# Altium schematic sheet Sheet2.SchDoc
size A; SheetNumber: 2; SheetTotal: 2
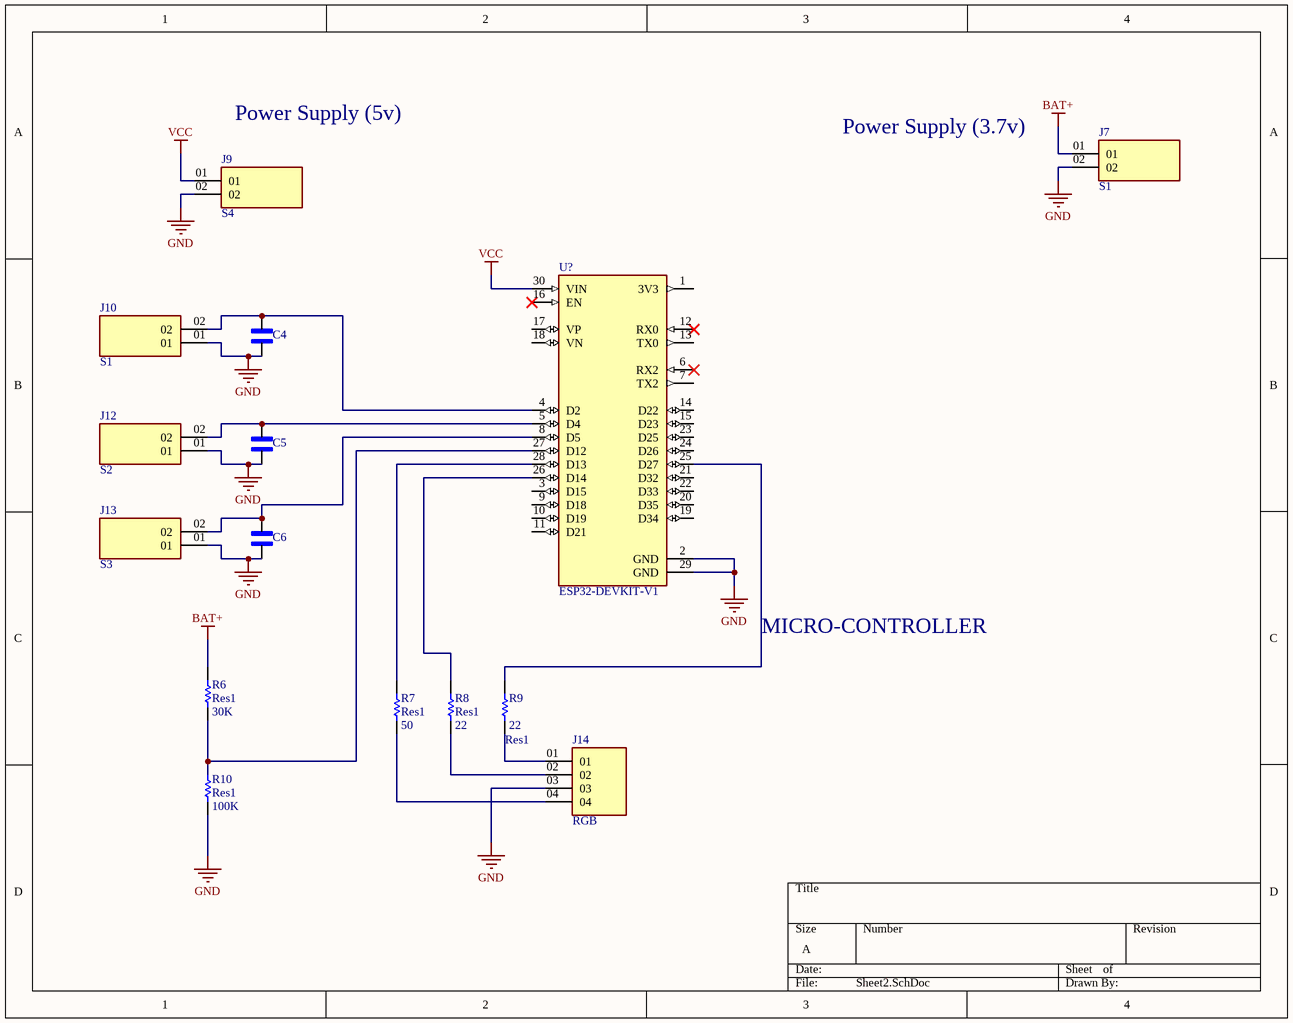
[diagram p0: Sheet2.SchDoc]

## Parts
C4  C315C470J1G5TA  [CAPRR254W54L381T254H466]  (value not drawn)
C5  C315C470J1G5TA  [CAPRR254W54L381T254H466]  (value not drawn)
C6  C315C470J1G5TA  [CAPRR254W54L381T254H466]  (value not drawn)
J7  S1  [SAMTEC_TSW-202-07-T-S]
J9  S4  [SAMTEC_TSW-202-07-T-S]
J10  S1  [SAMTEC_TSW-202-07-T-S]
J12  S2  [SAMTEC_TSW-202-07-T-S]
J13  S3  [SAMTEC_TSW-202-07-T-S]
J14  RGB  [SAMTEC_MTLW-104-X-X-S-X]
R6  Res1  value 30K  [AXIAL-0.3]
R7  Res1  value 50  [AXIAL-0.3]
R8  Res1  value 22  [AXIAL-0.3]
R9  Res1  value 22  [AXIAL-0.3]
R10  Res1  value 100K  [AXIAL-0.3]
U?  ESP32-DEVKIT-V1  [MODULE_ESP32_DEVKIT_V1]

## Nets
BAT+: J7.01 R6.1
GND: C4.1 C5.1 C6.1 J7.02 J9.02 J10.01 J12.01 J13.01 J14.03 R10.2 U?.2(GND) U?.29(GND)
VCC: J9.01 U?.30(VIN)
NetC4_2: C4.2 J10.02 U?.4(D2)
NetC5_2: C5.2 J12.02 U?.5(D4)
NetC6_2: C6.2 J13.02 U?.8(D5)
NetJ14_01: J14.01 R9.2
NetJ14_02: J14.02 R8.2
NetJ14_04: J14.04 R7.2
NetR6_2: R6.2 R10.1 U?.27(D12)
NetR7_1: R7.1 U?.28(D13)
NetR8_1: R8.1 U?.26(D14)
NetR9_1: R9.1 U?.25(D27)

Not connected (* = marked no-connect by the designer): U? 1(3V3) 3(D15) 6(RX2)* 7(TX2) 9(D18) 10(D19) 11(D21) 12(RX0)* 13(TX0) 14(D22) 15(D23) 16(EN)* 17(VP) 18(VN) 19(D34) 20(D35) 21(D32) 22(D33) 23(D25) 24(D26)

## Notes on the sheet
- Power Supply (5v)
- (near J7) Power Supply (3.7v)
- MICRO-CONTROLLER

## Library data of the parts
C4-C6 = C315C470J1G5TA: Capacitor: ceramic; MLCC, monolithic; 47pF; 100V; C0G; Â±5%; THT; MF: KEMET; SnapEDA_Link: https://www.snapeda.com/parts/C315C470J1G5TA/KEMET/view-part/?ref=snap; Package: Radial Kemet; Value: *; MP: C315C470J1G5TA; Check_prices: https://www.snapeda.com/parts/C315C470J1G5TA/KEMET/view-part/?ref=eda
J7 J9 J10 J12 J13 = TSW-202-07-T-S: Value: *; MP: TSW-202-07-T-S; Availability: Unavailable; Package: None; Price: None
J14 = MTLW-104-X-X-S-X: MF: {'manufacturer': u'Samtec Inc.'}; Package: None; Price: None; Value: *; MP: MTLW-104-X-X-S-X; Availability: Unavailable
R6-R10 = Res1: Resistor; Published: 8-Jun-2000; LatestRevisionDate: 17-Jul-2002; LatestRevisionNote: Re-released for DXP Platform.; PackageReference: AXIAL-0.3; Publisher: Altium Limited; PackageDescription: Axial Device, Thru-Hole; 2 Leads; 0.3 in Pin Spacing
U? = ESP32-DEVKIT-V1: Dual core, Wi-Fi: 2.4 GHz up to 150 Mbits/s,BLE (Bluetooth Low Energy) and legacy Bluetooth, 32 bits, Up to 240 MHz; MF: Do it; Price: None; Availability: Not in stock; Package: None; MP: ESP32-DEVKIT-V1; Value: *; SnapEDA_Link: https://www.snapeda.com/parts/ESP32-DEVKIT-V1/Do+it/view-part/?ref=snap; Check_prices: https://www.snapeda.com/parts/ESP32-DEVKIT-V1/Do+it/view-part/?ref=eda